# Altium schematic sheet prism_mainboard.SchDoc
size 297 x 209 mm
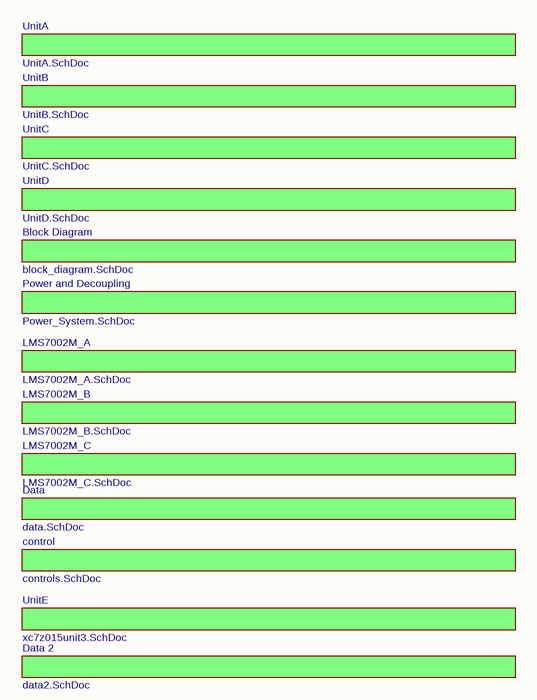
[diagram p0: prism_mainboard.SchDoc]

## Sub-sheets
Block Diagram = block_diagram.SchDoc: no entries
control = controls.SchDoc: no entries
Data = data.SchDoc: no entries
Data 2 = data2.SchDoc: no entries
LMS7002M_A = LMS7002M_A.SchDoc: no entries
LMS7002M_B = LMS7002M_B.SchDoc: no entries
LMS7002M_C = LMS7002M_C.SchDoc: no entries
Power and Decoupling = Power_System.SchDoc: no entries
UnitA = UnitA.SchDoc: no entries
UnitB = UnitB.SchDoc: no entries
UnitC = UnitC.SchDoc: no entries
UnitD = UnitD.SchDoc: no entries
UnitE = xc7z015unit3.SchDoc: no entries

## Notes on the sheet
- 1
- 2
- 3
- 4
- 5
- 6
- A
- B
- C
- D
- Title: PRISM MAINBOARD
- File: prism_mainboard.kicad_sch
- Sheet: /
- Stark Interests
- KiCad E.D.A.  kicad (5.1.4)-1
- Size: A4
- Date: 2026-05-15
- Rev: v0.01
- Id: 1/1